# Altium schematic sheet INPUT DEVICE.SchDoc
size A3; Date: 09/11/2025; Author: Hung Le; Revision: v1; SheetNumber: 4; SheetTotal: 4; Size: A3
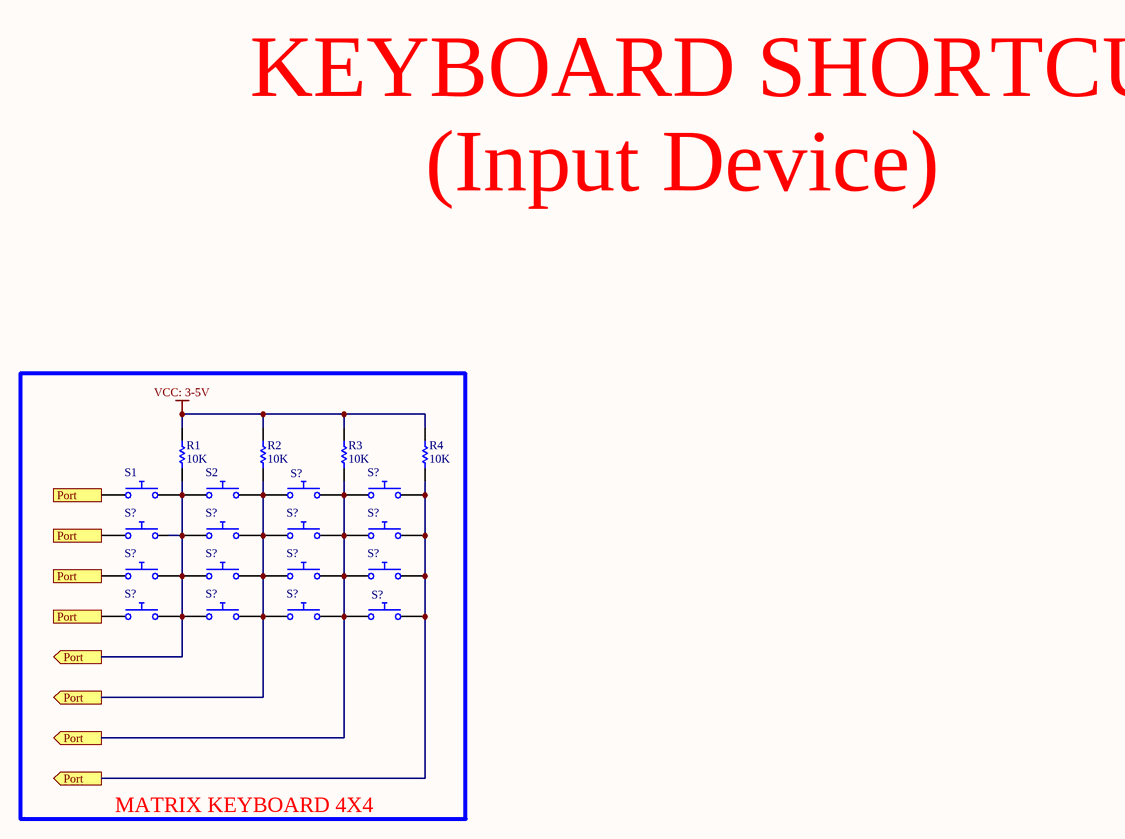
[diagram p0: INPUT DEVICE.SchDoc]

## Parts
(Parts that share a designator on the sheet are numbered #1, #2 ... from top to bottom, then left to right.)
R1  value 10K  (hidden comment: Resistor)
R2  value 10K  (hidden comment: Resistor)
R3  value 10K  (hidden comment: Resistor)
R4  value 10K  (hidden comment: Resistor)
S1  Push Button Normally Opened  (value not drawn)
S2  Push Button Normally Opened  (value not drawn)
S?#1  Push Button Normally Opened  (value not drawn)
S?#2  Push Button Normally Opened  (value not drawn)
S?#3  Push Button Normally Opened  (value not drawn)
S?#4  Push Button Normally Opened  (value not drawn)
S?#5  Push Button Normally Opened  (value not drawn)
S?#6  Push Button Normally Opened  (value not drawn)
S?#7  Push Button Normally Opened  (value not drawn)
S?#8  Push Button Normally Opened  (value not drawn)
S?#9  Push Button Normally Opened  (value not drawn)
S?#10  Push Button Normally Opened  (value not drawn)
S?#11  Push Button Normally Opened  (value not drawn)
S?#12  Push Button Normally Opened  (value not drawn)
S?#13  Push Button Normally Opened  (value not drawn)
S?#14  Push Button Normally Opened  (value not drawn)

## Blocks framed on the sheet
MATRIX KEYBOARD 4X4: R1-R4 S1 S2 S?#1-S?#14

## Ports
Port (in, see INPUT DEVICE[2B], INPUT DEVICE[2C]), Port (out, see INPUT DEVICE[2B], INPUT DEVICE[2C])

## Nets
VCC: 3-5V: R1.2 R2.2 R3.2 R4.2
Port: R1.1 R2.1 R3.1 R4.1 S1.1 S1.2 S2.1 S2.2 S?#1.1 S?#1.2 S?#2.1 S?#2.2 S?#3.1 S?#3.2 S?#4.1 S?#4.2 S?#5.1 S?#5.2 S?#6.1 S?#6.2 S?#7.1 S?#7.2 S?#8.1 S?#8.2 S?#9.1 S?#9.2 S?#10.1 S?#10.2 S?#11.1 S?#11.2 S?#12.1 S?#12.2 S?#13.1 S?#13.2 S?#14.1 S?#14.2 ; port Port

## Notes on the sheet
- KEYBOARD SHORTCUT
- (Input Device)
- Project:
- Page Content:
- Revision:
- Size:
- Design by:
- Document number:
- Date:
- Sheet       of

## Library data of the parts
R1-R4 = Resistor: TC1: 0; SimulationGenericComponent: True; TC2: 0
S1 S2 S?#1-S?#14 = Push Button NO: closed: 0; Rclosed: 1m; Ropen: 1Meg; SimulationGenericComponent: True